# Altium schematic sheet RS232.SchDoc
size A3; SheetNumber: 4; SheetTotal: 8
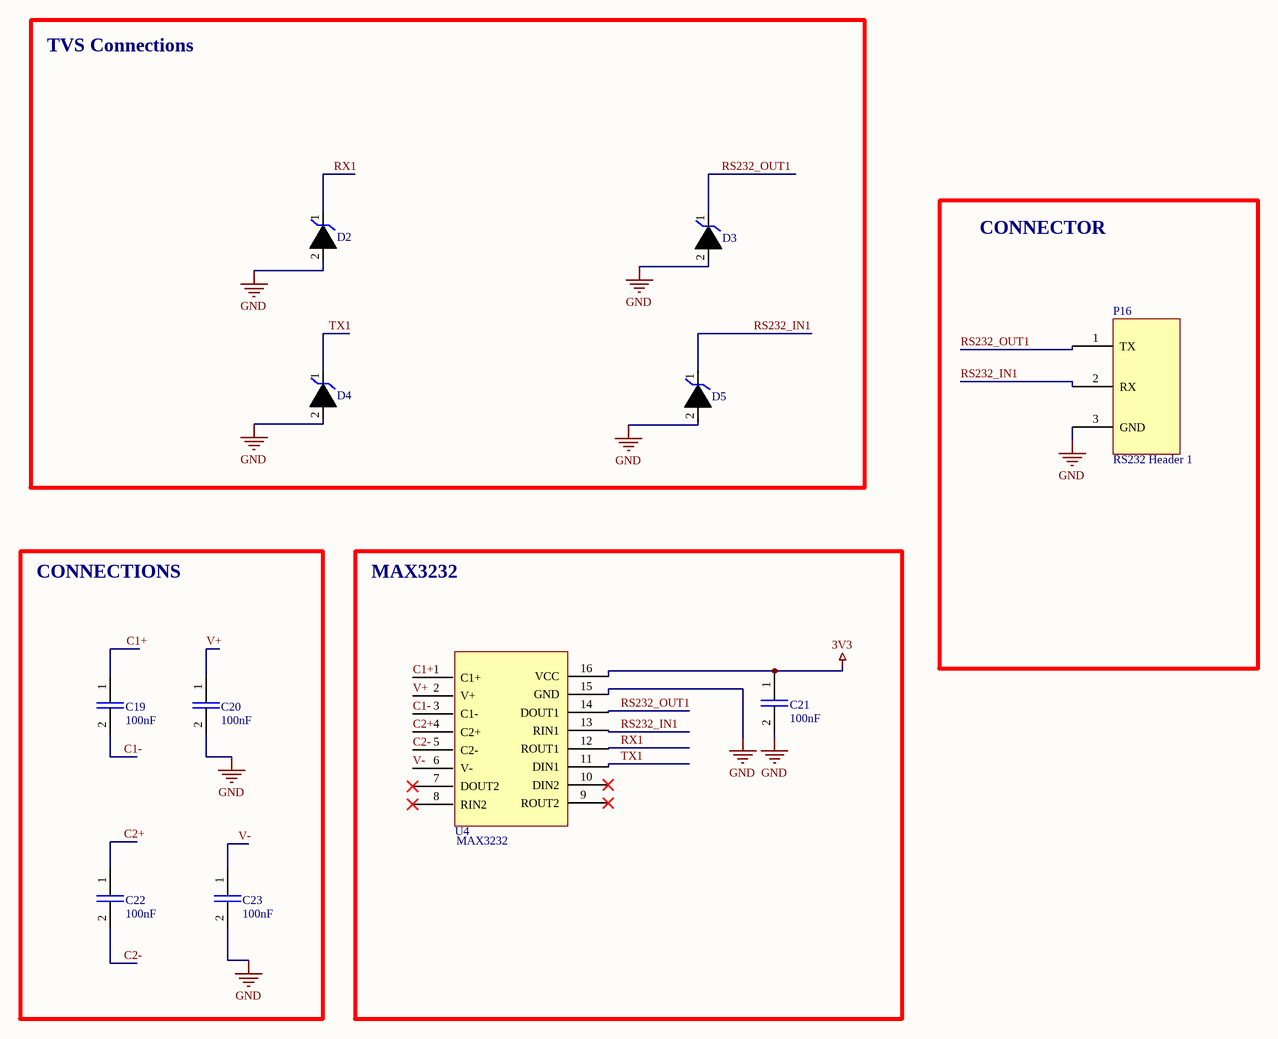
[diagram p0: RS232.SchDoc]

## Parts
C19  value 100nF  [0603 Cap]  (hidden comment: 0603 Capacitor)
C20  value 100nF  [0603 Cap]  (hidden comment: 0603 Capacitor)
C21  value 100nF  [0603 Cap]  (hidden comment: 0603 Capacitor)
C22  value 100nF  [0603 Cap]  (hidden comment: 0603 Capacitor)
C23  value 100nF  [0603 Cap]  (hidden comment: 0603 Capacitor)
D2  TVS  [TVS DIODE]  (value not drawn)
D3  TVS  [TVS DIODE]  (value not drawn)
D4  TVS  [TVS DIODE]  (value not drawn)
D5  TVS  [TVS DIODE]  (value not drawn)
P16  RS232 Header 1  [WR-TBL 322 3H]
U4  MAX3232  [16-PIN SOIC]

## Blocks framed on the sheet
TVS Connections: D2-D5
CONNECTOR: P16
CONNECTIONS: C19 C20 C22 C23
MAX3232: C21 U4

## Nets
3V3: C21.1 U4.16(VCC)
GND: C20.2 C21.2 C23.2 D2.2 D3.2 D4.2 D5.2 P16.3(GND) U4.15(GND)
C1+: C19.1 U4.1(C1+)
C1-: C19.2 U4.3(C1-)
C2+: C22.1 U4.4(C2+)
C2-: C22.2 U4.5(C2-)
RS232_IN1: D5.1 P16.2(RX) U4.13(RIN1)
RS232_OUT1: D3.1 P16.1(TX) U4.14(DOUT1)
RX1: D2.1 U4.12(ROUT1)
TX1: D4.1 U4.11(DIN1)
V+: C20.1 U4.2(V+)
V-: C23.1 U4.6(V-)

Not connected (* = marked no-connect by the designer): U4 7(DOUT2)* 8(RIN2)* 9(ROUT2)* 10(DIN2)*

## Library data of the parts
C19-C23 = 0603 Cap: SMD 0603 (ceramic) capacitor; Manufacturer: Murata; Manufacturer Part Number: GRM21BR71C225KA12L; Multilayer: Yes; Tolerance  (fill in as +-): 10%; Rated DC Voltage (URdc): 16V; Temperature Characteristics Code: X7R; Supplier: Mouser; Supplier Part Number: 81-GRM21BR71C225KA2L; RoHS: Yes; Category: Ceramic Capacitors; Stock: 30148; Pricing: 1=0,3, 10=0,163, 50=0,163, 100=0,098, 1000=0,07, 10000=0,054 (USD); Mounting Technology: Surface Mount; Pins: 2; Package Shape: Rectangular; Terminal Finish: Nickel; Dielectric Material: Ceramic; Case/Package: 0805; Min Operating Temperature: -55°C; Max Operating Temperature: 125°C; JESD-609 Code: e3; Package Style: SMTMeter; Capacitor Type: Ceramic; Packaging: Tape and Reel; Tolerance (fill in as +-): 10%; Termination: Wraparound; Length: 2mm; Width: 1.25mm; Height: 1.25mm; Reach SVHC Compliant: Yes; RoHS Compliant: Yes; ComponentLink1URL: https://datasheet.ciiva.com:443/pdfs/VipMasterIC/IC/MURE/MURE-S-A0004349797/MURE-S-A0004361718-1.pdf?src-supplier=IHS+Markit; ComponentLink1Description: https://datasheet.ciiva.com:443/pdfs/VipMasterIC/IC/MURE/MURE-S-A0004349797/MURE-S-A0004361718-1.pdf?src-supplier=IHS+Markit; ComponentLink2URL: https://datasheet.ciiva.com/7937/608985-7937701.pdf?src-supplier=Element14; ComponentLink2Description: https://datasheet.ciiva.com/7937/608985-7937701.pdf?src-supplier=Element14
D2-D5 = TVS Diode: Schematic for TVS diode
P16 = 322-3H: 322 Series 3 pin header
U4 = 16-PIN SOIC: 16-Pin SOIC package IC schematic